# Altium schematic sheet Kajtuś-DSP_analog_in.SchDoc
size A4; DocumentNumber: 4; SheetNumber: 4; SheetTotal: 9
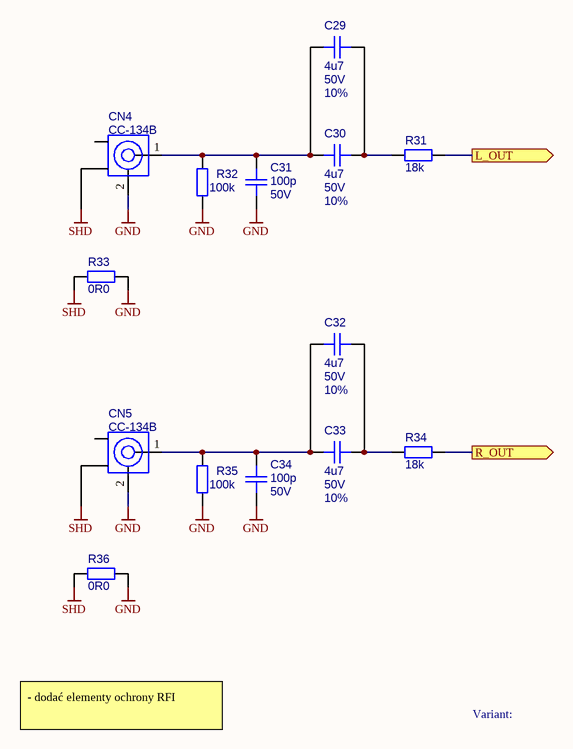
[diagram p0: Kajtuś-DSP_analog_in.SchDoc]

## Parts
C29  Voltage: 50V  Tolerance: 10%  [C_R5-L7.2-W7.2-H13]  (hidden comment: 4u7)
C30  Voltage: 50V  Tolerance: 10%  [C_R5-L7.2-W7.2-H13]  (hidden comment: 4u7)
C31  value 100p  Voltage: 50V  [C_0603_MA]  (hidden comment: C_0603_100p_50V_COG)
C32  Voltage: 50V  Tolerance: 10%  [C_R5-L7.2-W7.2-H13]  (hidden comment: 4u7)
C33  Voltage: 50V  Tolerance: 10%  [C_R5-L7.2-W7.2-H13]  (hidden comment: 4u7)
C34  value 100p  Voltage: 50V  [C_0603_MA]  (hidden comment: C_0603_100p_50V_COG)
CN4  CC-134B  [CN_RCA_CC-134x]
CN5  CC-134B  [CN_RCA_CC-134x]
R31  18k  [R_1206_MA]
R32  value 100k  [R_0603_MA]  (hidden comment: R_0603_100k_5%)
R33  value 0R0  [R_0603_MA]  (hidden comment: R_0603_0R0_5%)
R34  18k  [R_1206_MA]
R35  value 100k  [R_0603_MA]  (hidden comment: R_0603_100k_5%)
R36  value 0R0  [R_0603_MA]  (hidden comment: R_0603_0R0_5%)

## Ports
L_OUT (out), R_OUT (out)

## Nets
GND: C31.2 C34.2 CN4.2 CN5.2 R32.2 R33.2 R35.2 R36.2
SHD: CN4.SH2 CN5.SH2 R33.1 R36.1
L_OUT: R31.2 ; port L_OUT
R_OUT: R34.2 ; port R_OUT
NetC29_1: C29.1 C30.1 C31.1 CN4.1 R32.1
NetC29_2: C29.2 C30.2 R31.1
NetC32_1: C32.1 C33.1 C34.1 CN5.1 R35.1
NetC32_2: C32.2 C33.2 R34.1

Not connected (* = marked no-connect by the designer): CN4 SH1; CN5 SH1

## Notes on the sheet
- - dodać elementy ochrony RFI
- Variant:
- Title
- Size:
- Date:
- A4
- Number:
- Time:
- Revision:
- Sheet
- of
- File:

## Library data of the parts
C29 C30 C32 C33 = C_R5-L7.2-W7.2-H13_4u7_50V_MKS2_10%: Kondensator tworzywowy; Manufacturer: Wima; Vendor: TME; Part Number: C_R5-L7.2-W7.2-H13_4u7_50V_MKS2_10%; Value: 4u7
C31 C34 = C_0603_100p_50V_COG: Kondensator ceramiczny SMD; Manufacturer: KEMET; Manufacturer Part Number: C0603C101J5GAC; Vendor: TME; Part Number: C_0603_100p_50V_COG; Vendor Part Number: C0603C101J5GAC
CN4 CN5 = CN_RCA_CC-134B: Gniazdo RCA, żeńskie, ekranowane, kątowe 90°; do druku, THT, niklowane; Manufacturer: ??; Vendor: TME; Part Number: CN_RCA_CC-134B; Vendor Part Number: CC-134B; Manufacturer Part Number: CC-134B; Value: CC-134B
R31 R34 = R_SMD_generic: SMD resistor; Part Number: ?; Vendor: ?; Manufacturer: ?; Tolerance: ?; Value: 18k
R32 R35 = R_0603_100k_5%: Rezystor SMD; Manufacturer: Royal Ohm; Vendor: TME; Tolerance: 5%; Part Number: R_0603_100k_5%
R33 R36 = R_0603_0R0_5%: Rezystor SMD; Manufacturer: Royal Ohm; Vendor: TME; Part Number: R_0603_0R0_5%